# EAGLE design Translator (EAGLE 5.11)
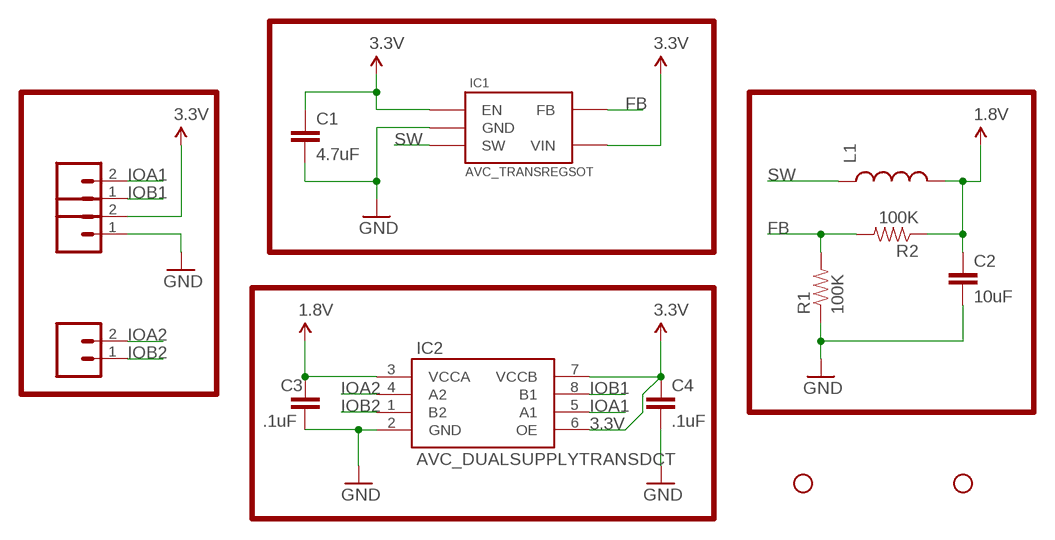
[diagram p0: schematic, sheet 1]

## Parts
1V8HEAD  M02PTH  [1X02]
1V8HEAD1  M02PTH  [1X02]
1V8HEAD2  M02PTH  [1X02]
C1  4.7uF  CAP0402-CAP  [0402-CAP]
C2  10uF  CAP0402-CAP  [0402-CAP]
C3  .1uF  CAP0402-CAP  [0402-CAP]
C4  .1uF  CAP0402-CAP  [0402-CAP]
IC1  AVC_TRANSREGSOT  [SOT23-5]
IC2  AVC_DUALSUPPLYTRANSDCT  [DCT8]
JP1  STAND-OFF  [STAND-OFF]
JP4  STAND-OFF  [STAND-OFF]
L1  INDUCTOR0603  [0603]
R1  100K  RESISTOR0603-RES  [0603-RES]
R2  100K  RESISTOR0603-RES  [0603-RES]

## Nets
1.8V: C2.1 C3.1 IC2.3(VCCA) L1.2 R2.1
3.3V: 1V8HEAD1.2 C1.1 C4.1 IC1.1(EN) IC1.4(VIN) IC2.6(OE) IC2.7(VCCB)
FB: IC1.5(FB) R1.2 R2.2
GND: 1V8HEAD1.1 C1.2 C2.2 C3.2 C4.2 IC1.2(GND) IC2.2(GND) R1.1
IOA1: 1V8HEAD2.2 IC2.5(A1)
IOA2: 1V8HEAD.2 IC2.4(A2)
IOB1: 1V8HEAD2.1 IC2.8(B1)
IOB2: 1V8HEAD.1 IC2.1(B2)
SW: IC1.3(SW) L1.1

## Library data of the parts
1V8HEAD 1V8HEAD1 1V8HEAD2 = SparkFun:M02: Header 2 Standard 2-pin 0.1" header. Use with straight break away headers (SKU : PRT-00116), right angle break away headers (PRT-00553), swiss pins (PRT-00743), machine pins (PRT-00117), and female headers (PRT-00115). Molex polarized connector foot print use with SKU : PRT-08233 with associated crimp pins and housings.
C1-C4 = SparkFun:CAP: Capacitor Standard 0603 ceramic capacitor, and 0.1" leaded capacitor.
IC1 = Avc:AVC_TRANSREG
IC2 = Avc:AVC_DUALSUPPLYTRANS: TXB010
JP1 JP4 = SparkFun:STAND-OFF: Stand Off This is the mechanical footprint for a #4 phillips button head screw. Use the keepout ring to avoid running the screw head into surrounding components. SKU : PRT-00447
L1 = SparkFun:INDUCTOR: Inductors Basic Inductor/Choke - 0603 and 1206. Footprints are not proven and vary greatly between part numbers.
R1 R2 = SparkFun:RESISTOR: Resistor Basic schematic elements and footprints for 0603, 1206, and PTH resistors.

## Board
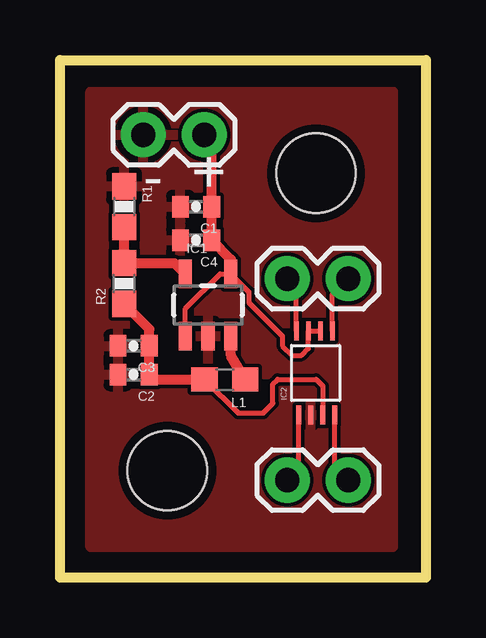
[diagram p1: board, top side]

Size 15.24 x 21.59 mm. Coordinates in mm from the lower left corner, seen from the top.
Outline: 0,0 0,21.59 15.24,21.59 15.24,0 0,0
Copper layers (1*16): Top 0.0356mm / dielectric 1.5011mm / Bottom 0.0356mm
Design rules "LaenPCBOrder": minimum track width 6mil, minimum drill 13mil, track to track 6mil, track to pad 6mil, pad to pad 6mil, via to via 6mil, smd to smd 6mil, copper to edge 15mil, drill to drill 6mil, minimum pad ring 7mil, minimum via ring 7mil, stop-mask expansion 4mil, vias tented up to drill 0mil, thermal gap 10mil

### Footprints (pad centres in the part's own frame; a part is rotated, then mirrored left to right if it is on the bottom)
1X02 = drill 1.016 pad 1.88 round: 1 0,0; 2 2.54,0
0402-CAP = smd 0.7 x 0.9: 1 -0.65,0; 2 0.65,0
SOT23-5 = smd 0.55 x 1.2: 1 -0.95,-1.3; 2 0,-1.3; 3 0.95,-1.3; 4 0.95,1.3; 5 -0.95,1.3
DCT8 = smd 0.2 x 0.8: 1 -0.62,-1.78; 2 -0.12,-1.78; 3 0.38,-1.78; 4 0.88,-1.78; 5 0.78,1.72; 6 0.28,1.72; 7 -0.22,1.72; 8 -0.72,1.72
STAND-OFF = hole 3.302: 0,0
0603 = smd 1.1 x 1: 1 -0.85,0; 2 0.85,0
0603-RES = smd 1.1 x 1: 1 -0.85,0; 2 0.85,0

### Placement (x,y rotation side)
1V8HEAD  9.47,4.07 0 top
1V8HEAD1  3.47,18.47 0 top
1V8HEAD2  9.47,12.47 0 top
C1  5.67,15.47 180 top
C2  3.07,8.47 180 top
C3  3.07,9.67 180 top
C4  5.67,14.07 180 top
IC1  6.17,11.37 0 top
IC2  10.57,8.57 0 top
JP1  10.67,16.87 0 top
JP4  4.47,4.47 0 top
L1  6.87,8.27 180 top
R1  2.67,15.47 270 top
R2  2.67,12.27 90 top

### Tracks (layer width: path | path; a pad name or v marks a point on that pad's centre or on a via)
1.8V
  Top 0.2: L1.2 7.42,6.87 8.47,6.87 8.87,7.27 8.87,8.07 9.07,8.27 10.67,8.27 10.95,7.99 IC2.3
  Top 0.406: R2.1 3.72,10.37 C3.1 C2.1 3.92,8.27 L1.2
3.3V
  Top 0.2: IC2.6 IC2.7 10.35,9.55 10.07,9.27 9.67,9.27 9.27,9.67 9.27,10.07 7.87,11.47 7.87,11.92 IC1.4 | IC1.1 5.22,11.22 6.67,12.67 IC1.4 | IC1.4
  Top 0.406: 1V8HEAD1.2 6.32,18.16 C1.1 C4.1 7.12,13.27 IC1.4
FB
  Top 0.406: R1.2 R2.2 4.77,13.12 IC1.5
GND
  pour Top: 1.27,20.27 13.87,20.27 13.87,1.27 1.27,1.27
IOA1
  Top 0.2: IC2.5 11.35,11.81 1V8HEAD2.2
IOA2
  Top 0.2: IC2.4 11.45,4.63 1V8HEAD.2
IOB1
  Top 0.2: IC2.8 9.85,12.09 1V8HEAD2.1
IOB2
  Top 0.2: IC2.1 9.95,4.55 1V8HEAD.1
SW
  Top 0.406: IC1.3 7.12,9.27 L1.1

### Text on the board
_tsilk: - | +